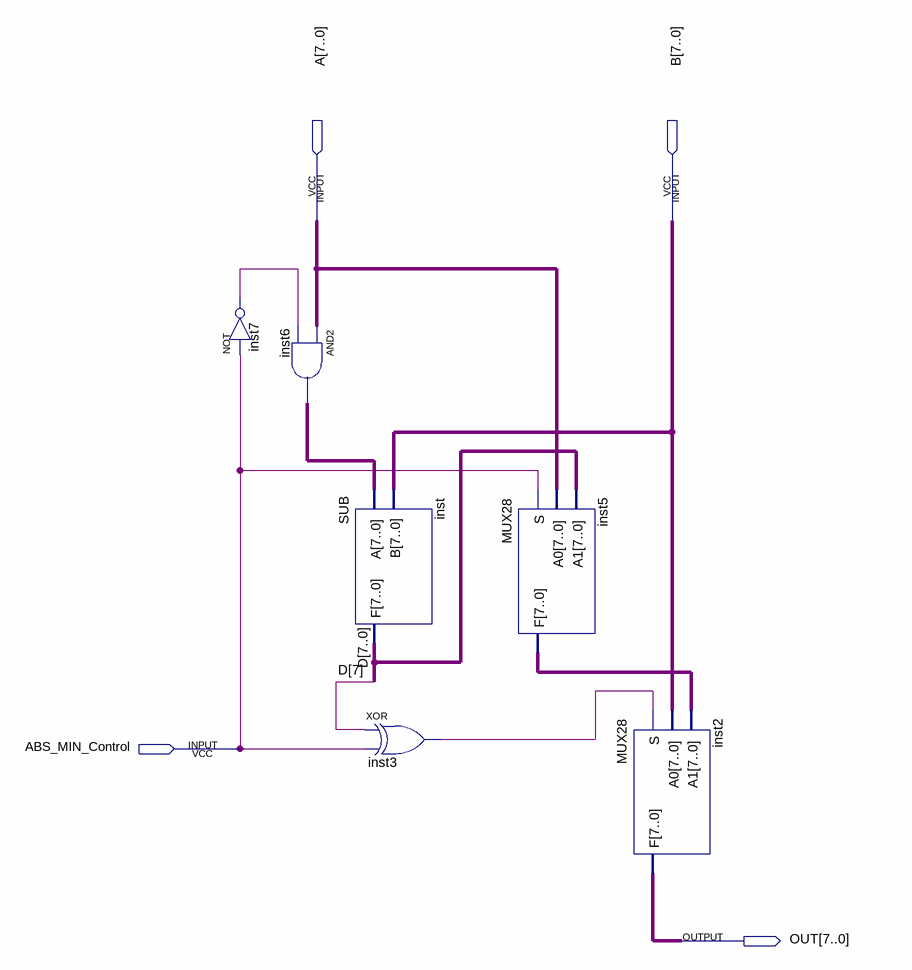
[diagram p0: schematic sheet]
// Quartus schematic ABS_MIN.bdf as structural Verilog: 6 symbols, 4 pins
module ABS_MIN (
  input  [7:0] A,
  input  [7:0] B,
  input  ABS_MIN_Control,
  output [7:0] OUT
);

  wire inst3_out, inst7_out;
  wire [7:0] D, inst5_f, inst6_out;

  not inst7 (inst7_out, ABS_MIN_Control);
  assign inst6_out = A & {8{inst7_out}};  // AND2 inst6, 8 bits wide
  SUB inst (.A(inst6_out), .B(B), .F(D));
  xor inst3 (inst3_out, D[7], ABS_MIN_Control);
  MUX28 inst5 (.S(ABS_MIN_Control), .A0(A), .A1(D), .F(inst5_f));
  MUX28 inst2 (.S(inst3_out), .A0(B), .A1(inst5_f), .F(OUT));
endmodule
